# EAGLE design game_board (EAGLE 9.3.2)
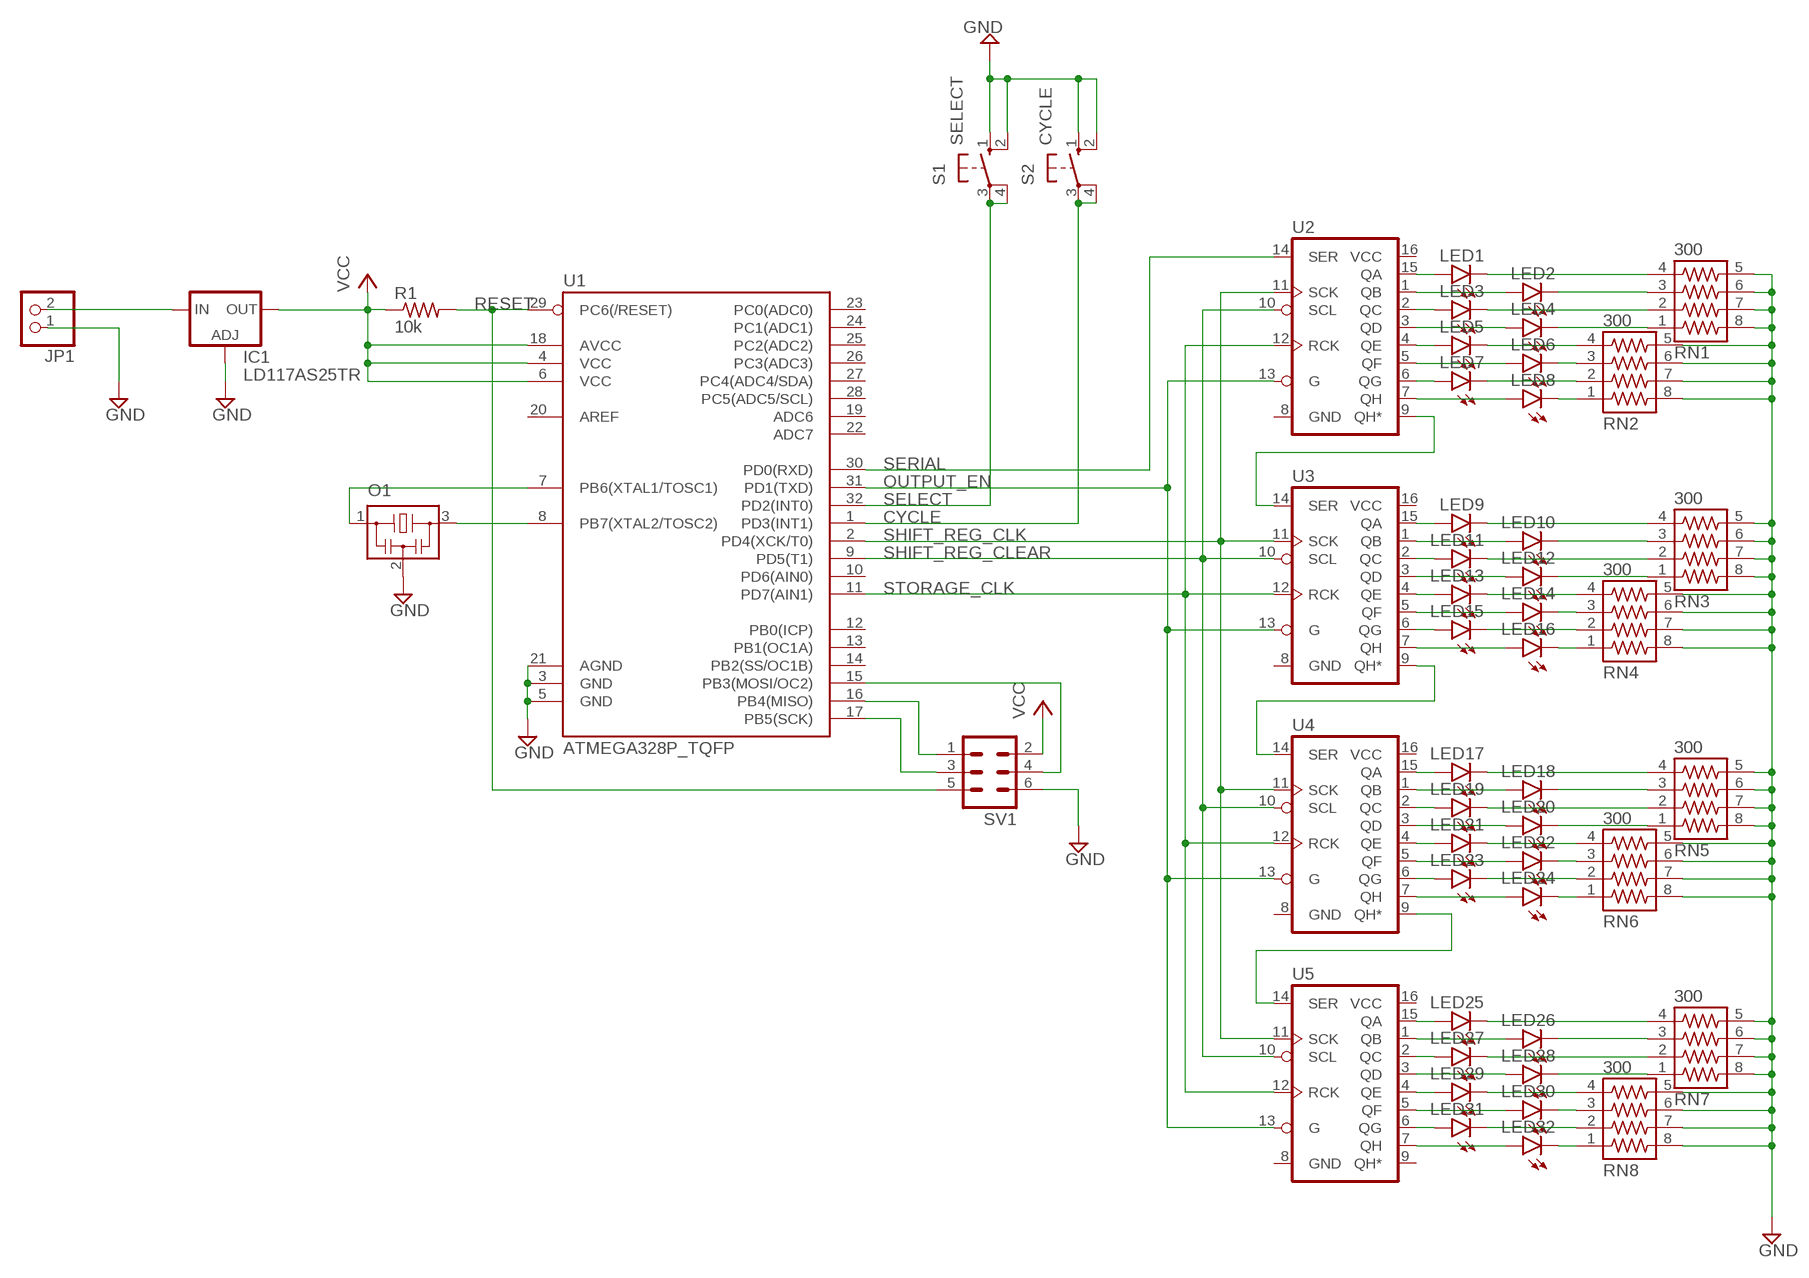
[diagram p0: schematic, sheet 1]

## Parts
IC1  LD117AS25TR  [SOT223]
JP1  PINHD-1X2  [1X02]
LED1  LEDSML0805  [SML0805]
LED2  LEDSML0805  [SML0805]
LED3  LEDSML0805  [SML0805]
LED4  LEDSML0805  [SML0805]
LED5  LEDSML0805  [SML0805]
LED6  LEDSML0805  [SML0805]
LED7  LEDSML0805  [SML0805]
LED8  LEDSML0805  [SML0805]
LED9  LEDSML0805  [SML0805]
LED10  LEDSML0805  [SML0805]
LED11  LEDSML0805  [SML0805]
LED12  LEDSML0805  [SML0805]
LED13  LEDSML0805  [SML0805]
LED14  LEDSML0805  [SML0805]
LED15  LEDSML0805  [SML0805]
LED16  LEDSML0805  [SML0805]
LED17  LEDSML0805  [SML0805]
LED18  LEDSML0805  [SML0805]
LED19  LEDSML0805  [SML0805]
LED20  LEDSML0805  [SML0805]
LED21  LEDSML0805  [SML0805]
LED22  LEDSML0805  [SML0805]
LED23  LEDSML0805  [SML0805]
LED24  LEDSML0805  [SML0805]
LED25  LEDSML0805  [SML0805]
LED26  LEDSML0805  [SML0805]
LED27  LEDSML0805  [SML0805]
LED28  LEDSML0805  [SML0805]
LED29  LEDSML0805  [SML0805]
LED30  LEDSML0805  [SML0805]
LED31  LEDSML0805  [SML0805]
LED32  LEDSML0805  [SML0805]
O1  CSTNE16M0V530000R0  [CSTCR6M]
R1  10k  R-US_R0603  [R0603]
RN1  300  1206_4RES_ARRAY1206  [RESCAXS80P320X250X60-8]
RN2  300  1206_4RES_ARRAY1206  [RESCAXS80P320X250X60-8]
RN3  300  1206_4RES_ARRAY1206  [RESCAXS80P320X250X60-8]
RN4  300  1206_4RES_ARRAY1206  [RESCAXS80P320X250X60-8]
RN5  300  1206_4RES_ARRAY1206  [RESCAXS80P320X250X60-8]
RN6  300  1206_4RES_ARRAY1206  [RESCAXS80P320X250X60-8]
RN7  300  1206_4RES_ARRAY1206  [RESCAXS80P320X250X60-8]
RN8  300  1206_4RES_ARRAY1206  [RESCAXS80P320X250X60-8]
S1  SELECT  10-XX  [B3F-10XX]
S2  CYCLE  10-XX  [B3F-10XX]
SV1  MA03-2  [MA03-2]
U1  ATMEGA328P_TQFP  [TQFP32-08]
U2  74595  [TSSOP16]
U3  74595  [TSSOP16]
U4  74595  [TSSOP16]
U5  74595  [TSSOP16]

## Nets
CYCLE: S2.3(P) S2.4(P1) U1.1(PD3(INT1))
GND: IC1.1(ADJ) JP1.1 O1.2 RN1.5 RN1.6 RN1.7 RN1.8 RN2.5 RN2.6 RN2.7 RN2.8 RN3.5 RN3.6 RN3.7 RN3.8 RN4.5 RN4.6 RN4.7 RN4.8 RN5.5 RN5.6 RN5.7 RN5.8 RN6.5 RN6.6 RN6.7 RN6.8 RN7.5 RN7.6 RN7.7 RN7.8 RN8.5 RN8.6 RN8.7 RN8.8 S1.1(S) S1.2(S1) S2.1(S) S2.2(S1) SV1.6 U1.3(GND) U1.5(GND) U1.21(AGND)
MISO: SV1.1 U1.16(PB4(MISO))
MOSI: SV1.4 U1.15(PB3(MOSI/OC2))
N$1: O1.1 U1.7(PB6(XTAL1/TOSC1))
N$2: O1.3 U1.8(PB7(XTAL2/TOSC2))
N$3: LED17.A U4.15(QA)
N$4: LED18.A U4.1(QB)
N$5: LED17.C RN5.4
N$6: LED18.C RN5.3
N$7: U3.9(QH*) U4.14(SER)
N$8: U2.9(QH*) U3.14(SER)
N$9: U4.9(QH*) U5.14(SER)
N$10: LED1.A U2.15(QA)
N$11: LED2.A U2.1(QB)
N$12: LED1.C RN1.4
N$13: LED2.C RN1.3
N$14: LED3.A U2.2(QC)
N$15: LED3.C RN1.2
N$16: LED4.C RN1.1
N$17: LED4.A U2.3(QD)
N$18: LED5.A U2.4(QE)
N$19: LED6.A U2.5(QF)
N$20: LED5.C RN2.4
N$21: LED6.C RN2.3
N$22: LED7.C RN2.2
N$23: LED7.A U2.6(QG)
N$24: LED8.A U2.7(QH)
N$25: LED8.C RN2.1
N$26: LED9.A U3.15(QA)
N$27: LED10.A U3.1(QB)
N$28: LED9.C RN3.4
N$29: LED10.C RN3.3
N$30: LED11.A U3.2(QC)
N$31: LED11.C RN3.2
N$32: LED12.C RN3.1
N$33: LED12.A U3.3(QD)
N$34: LED13.A U3.4(QE)
N$35: LED14.A U3.5(QF)
N$36: LED13.C RN4.4
N$37: LED14.C RN4.3
N$38: LED15.C RN4.2
N$39: LED15.A U3.6(QG)
N$40: LED16.A U3.7(QH)
N$41: LED16.C RN4.1
N$42: LED19.A U4.2(QC)
N$43: LED19.C RN5.2
N$44: LED20.C RN5.1
N$45: LED20.A U4.3(QD)
N$46: LED21.A U4.4(QE)
N$47: LED22.A U4.5(QF)
N$48: LED21.C RN6.4
N$49: LED22.C RN6.3
N$50: LED23.C RN6.2
N$51: LED23.A U4.6(QG)
N$52: LED24.A U4.7(QH)
N$53: LED24.C RN6.1
N$54: LED25.A U5.15(QA)
N$55: LED26.A U5.1(QB)
N$56: LED25.C RN7.4
N$57: LED26.C RN7.3
N$58: LED27.A U5.2(QC)
N$59: LED27.C RN7.2
N$60: LED28.C RN7.1
N$61: LED28.A U5.3(QD)
N$62: LED29.A U5.4(QE)
N$63: LED30.A U5.5(QF)
N$64: LED29.C RN8.4
N$65: LED30.C RN8.3
N$66: LED31.C RN8.2
N$67: LED31.A U5.6(QG)
N$68: LED32.A U5.7(QH)
N$69: LED32.C RN8.1
N$76: IC1.3(IN) JP1.2
OUTPUT_EN: U1.31(PD1(TXD)) U2.13(G) U3.13(G) U4.13(G) U5.13(G)
RESET: R1.2 SV1.5 U1.29(PC6(/RESET))
SCK: SV1.3 U1.17(PB5(SCK))
SELECT: S1.3(P) S1.4(P1) U1.32(PD2(INT0))
SERIAL: U1.30(PD0(RXD)) U2.14(SER)
SHIFT_REG_CLEAR: U1.9(PD5(T1)) U2.10(SCL) U3.10(SCL) U4.10(SCL) U5.10(SCL)
SHIFT_REG_CLK: U1.2(PD4(XCK/T0)) U2.11(SCK) U3.11(SCK) U4.11(SCK) U5.11(SCK)
STORAGE_CLK: U1.11(PD7(AIN1)) U2.12(RCK) U3.12(RCK) U4.12(RCK) U5.12(RCK)
VCC: IC1.4(OUT) R1.1 SV1.2 U1.4(VCC) U1.6(VCC) U1.18(AVCC)
Unconnected: U1.10(PD6(AIN0)) U1.12(PB0(ICP)) U1.13(PB1(OC1A)) U1.14(PB2(SS/OC1B)) U1.19(ADC6) U1.20(AREF) U1.22(ADC7) U1.23(PC0(ADC0)) U1.24(PC1(ADC1)) U1.25(PC2(ADC2)) U1.26(PC3(ADC3)) U1.27(PC4(ADC4/SDA)) U1.28(PC5(ADC5/SCL)) U5.9(QH*)

## Power pins joined to a net without a drawn wire
GND: U2.8(GND) U3.8(GND) U4.8(GND) U5.8(GND)
VCC: U2.16(VCC) U3.16(VCC) U4.16(VCC) U5.16(VCC)

## Library data of the parts
IC1 = v-reg:LD117A?*: Low drop fixed and adjustable positive voltage regulators 1 A Source: http://www.st.com/stonline/products/literature/ds/7194/ld1117axx.pdf
JP1 = pinhead:PINHD-1X2: PIN HEADER
LED1-LED32 = led:LED: LED OSRAM: - CHIPLED LG R971, LG N971, LY N971, LG Q971, LY Q971, LO R971, LY R971 LH N974, LH R974 LS Q976, LO Q976, LY Q976 LO Q996 - Hyper CHIPLED LW Q18S LB Q993, LB Q99A, LB R99A - SideLED LS A670, LO A670, LY A670, LG A670, LP A670 LB A673, LV A673, LT A673, LW A673 LH A674 LY A675 LS A676, LA A676, LO A676, LY A676, LW A676 LS A679, LY A679, LG A679 - Hyper Micro SIDELED® LS Y876, LA Y876, LO Y876, LY Y876 LT Y87S - SmartLED LW L88C, LW L88S LB L89C, LB L89S, LG L890 LS L89K, LO L89K, LY L89K LS L896, LA L896, LO L896, LY L896 - TOPLED LS T670, LO T670, LY T670, LG T670, LP T670 LSG T670, LSP T670, LSY T670, LOP T670, LYG T670 LG T671, LOG T671, LSG T671 LB T673, LV T673, LT T673, LW T673 LH T674 LS T676, LA T676, LO T676, LY T676, LB T676, LH T676, LSB T676, LW T676 LB T67C, LV T67C, LT T67C, LS T67K, LO T67K, LY T67K, LW E67C LS E67B, LA E67B, LO E67B, LY E67B, LB E67C, LV E67C, LT E67C LW T67C LS T679, LY T679, LG T679 LS T770, LO T770, LY T770, LG T770, LP T770 LB T773, LV T773, LT T773, LW T773 LH T774 LS E675, LA E675, LY E675, LS T675 LS T776, LA T776, LO T776, LY T776, LB T776 LHGB T686 LT T68C, LB T68C - Hyper Mini TOPLED® LB M676 - Mini TOPLED Santana® LG M470 LS M47K, LO M47K, LY M47K Source: http://www.osram.convergy.de LUXEON: - LUMILED® LXK2-PW12-R00, LXK2-PW12-S00, LXK2-PW14-U00, LXK2-PW14-V00 LXK2-PM12-R00, LXK2-PM12-S00, LXK2-PM14-U00 LXK2-PE12-Q00, LXK2-PE12-R00, LXK2-PE12-S00, LXK2-PE14-T00, LXK2-PE14-U00 LXK2-PB12-K00, LXK2-PB12-L00, LXK2-PB12-M00, LXK2-PB14-N00, LXK2-PB14-P00, LXK2-PB14-Q00 LXK2-PR12-L00, LXK2-PR12-M00, LXK2-PR14-Q00, LXK2-PR14-R00 LXK2-PD12-Q00, LXK2-PD12-R00, LXK2-PD12-S00 LXK2-PH12-R00, LXK2-PH12-S00 LXK2-PL12-P00, LXK2-PL12-Q00, LXK2-PL12-R00 Source: www.luxeon.com KINGBRIGHT: KA-3528ASYC Source: www.kingbright.com
O1 = murata-resonators:CSTNE16M0V530000R0
R1 = resistor:R-US_: RESISTOR, American symbol
RN1-RN8 = res4array1206:1206_4RES_ARRAY
S1 S2 = switch-omron:10-XX: OMRON SWITCH; MPN: B3F-1000; OC_FARNELL: 176432; OC_NEWARK: 36M3542
SV1 = con-lstb:MA03-2: PIN HEADER; OC_FARNELL: unknown; OC_NEWARK: unknown
U1 = SparkFun-IC-Microcontroller:ATMEGA328P_TQFP: Popular 328P in QFP Storefront component: ATmega328 - TQFP <https://www.sparkfun.com/products/13448> (COM-13448) Datasheet <http://www.sparkfun.com/datasheets/Components/SMD/ATMega328.pdf> SparkFun Products SparkFun RedBoard - Programmed with Arduino <https://www.sparkfun.com/products/12757> (DEV-12757) Arduino Pro Mini 328 - 5V/16MHz <https://www.sparkfun.com/products/11113> (DEV-11113) Arduino Pro Mini 328 - 3.3V/8MHz <https://www.sparkfun.com/products/11114> (DEV-11114) SparkFun OpenLog <https://www.sparkfun.com/products/13712> (DEV-13712) SparkFun MicroView - OLED Arduino Module <https://www.sparkfun.com/products/12923> (DEV-12923) SparkFun Digital Sandbox <https://www.sparkfun.com/products/12651> (DEV-12651) SparkFun PicoBoard <https://www.sparkfun.com/products/11888> (WIG-11888) Arduino Fio <https://www.sparkfun.com/products/10116> (DEV-10116) LilyPad Arduino 328 Main Board <https://www.sparkfun.com/products/13342> (DEV-13342) SparkFun RedStick <https://www.sparkfun.com/products/13741> (DEV-13741) LilyPad MP3 <https://www.sparkfun.com/products/11013> (DEV-11013) LilyPad Arduino SimpleSnap <https://www.sparkfun.com/products/10941> (DEV-10941) SparkFun Stepoko <https://www.sparkfun.com/products/13899> (ROB-13899) SparkFun Geiger Counter <https://www.sparkfun.com/products/11345> (SEN-11345) SparkFun EL Sequencer <https://www.sparkfun.com/products/12781> (COM-12781) Arduino Pro 328 - 5V/16MHz <https://www.sparkfun.com/products/10915> (DEV-10915) CryptoCape <https://www.sparkfun.com/products/12773> (DEV-12773) SparkFun IR Thermometer Evaluation Board - MLX90614 <https://www.sparkfun.com/products/10740> (SEN-10740) SparkFun RedBot Mainboard <https://www.sparkfun.com/products/12097> (ROB-12097) Arduino Pro 328 - 3.3V/8MHz <https://www.sparkfun.com/products/10914> (DEV-10914) SparkFun Block for Intel® Edison - Arduino <https://www.sparkfun.com/products/13036> (DEV-13036) SparkFun Simon Says - Surface Mount Soldering Kit <https://www.sparkfun.com/products/10935> (KIT-10935) SparkFun 7-Segment Serial Display - Red <https://www.sparkfun.com/products/11441> (COM-11441) SparkFun 7-Segment Serial Display - White <https://www.sparkfun.com/products/11629> (COM-11629) SparkFun 7-Segment Serial Display - Yellow <https://www.sparkfun.com/products/11443> (COM-11443) SparkFun 7-Segment Serial Display - Kelly Green <https://www.sparkfun.com/products/11440> (COM-11440) SparkFun 7-Segment Serial Display - Blue <https://www.sparkfun.com/products/11442> (COM-11442) SparkFun OpenSegment Serial Display - 20mm (Blue) <https://www.sparkfun.com/products/11647> (COM-11647) SparkFun OpenSegment Serial Display - 20mm (Green) <https://www.sparkfun.com/products/11646> (COM-11646) SparkFun OpenSegment Serial Display - 20mm (White) <https://www.sparkfun.com/products/11648> (COM-11648) SparkFun OpenSegment Serial Display - 20mm (Red) <https://www.sparkfun.com/products/11644> (COM-11644) SparkFun OpenSegment Serial Display - 20mm (Yellow) <https://www.sparkfun.com/products/11645> (COM-11645) SparkFun OpenSegment Shield <https://www.sparkfun.com/products/13190> (DEV-13190); PROD_ID: IC-09069
U2-U5 = SparkFun-IC-Logic:74*595: 8-Bit Shift Register (Serial to Parallel) Datasheet <http://cdn.sparkfun.com/datasheets/BreakoutBoards/MM74HC595.pdf> SparkFun Products SparkFun Shift Register Breakout - 74HC595 <https://www.sparkfun.com/products/10680> (BOB-10680)

## Board
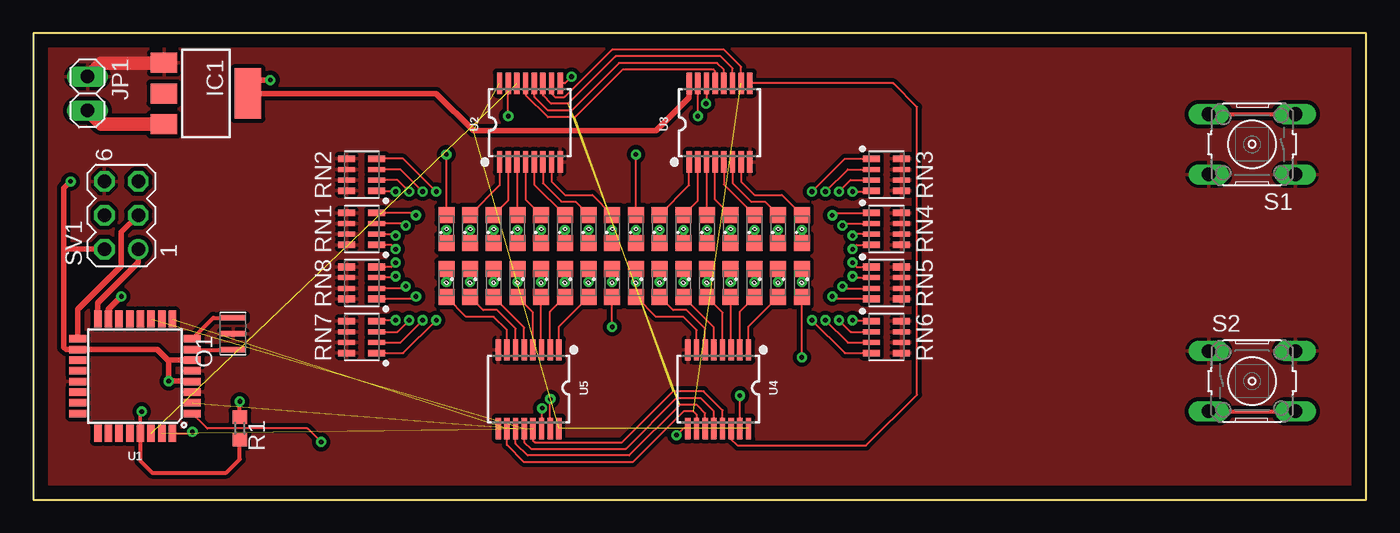
[diagram p1: board, top side]
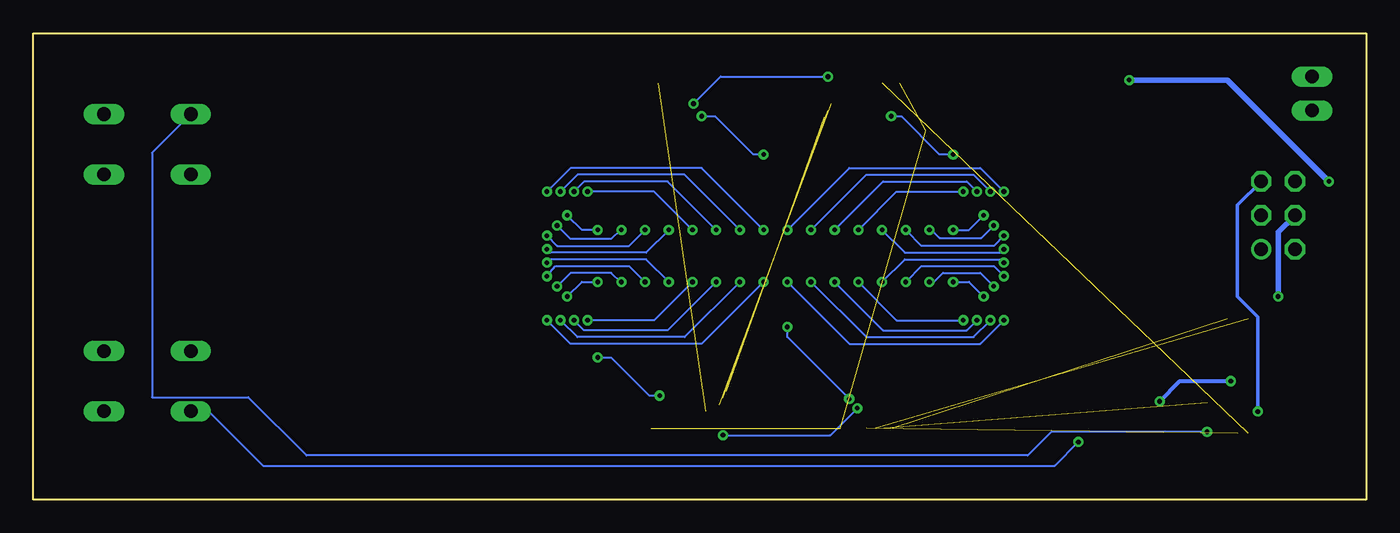
[diagram p2: board, bottom side, seen from below]

Size 100 x 35 mm. Coordinates in mm from the lower left corner, seen from the top.
Outline: 0,0 100,0 100,35 0,35 0,0
Copper layers (1*16): Top 0.035mm / dielectric 1.5mm / Bottom 0.035mm
Design rules "default": minimum track width 6mil, minimum drill 0.35mm, track to track 6mil, track to pad 6mil, pad to pad 6mil, via to via 6mil, smd to smd 6mil, copper to edge 40mil, drill to drill 6mil, minimum pad ring 10mil, minimum via ring 8mil, stop-mask expansion 4mil, vias tented up to drill 0mil, thermal gap 10mil

### Footprints (pad centres in the part's own frame; a part is rotated, then mirrored left to right if it is on the bottom)
SOT223 = smd 1.5 x 2: 1 -2.3,-3.15; 2 0,-3.15; 3 2.3,-3.15 | smd 3.8 x 2: 4 0,3.15
1X02 = drill 1.016 long: 1 -1.27,0; 2 1.27,0
SML0805 = smd 1.2 x 1.2: A 1.05,0; C -1.05,0
CSTCR6M = smd 0.4 x 1.9: 1 -1.2,0; 2 0,0; 3 1.2,0
R0603 = smd 1 x 1.1: 1 -0.85,0; 2 0.85,0
RESCAXS80P320X250X60-8 = smd 1.268 x 0.489: 1 -1.131,1.2; 4 -1.131,-1.2; 5 1.131,-1.2; 8 1.131,1.2 | smd 1.268 x 0.372: 2 -1.131,0.4; 3 -1.131,-0.4; 6 1.131,-0.4; 7 1.131,0.4
B3F-10XX = drill 1.016 long: 1 -3.251,2.261; 2 3.251,2.261; 3 -3.251,-2.261; 4 3.251,-2.261
MA03-2 = drill 1.016: 1 -2.54,-1.27 | drill 1.016 octagon: 2 -2.54,1.27; 3 0,-1.27; 4 0,1.27; 5 2.54,-1.27; 6 2.54,1.27
TQFP32-08 = smd 1.27 x 0.559: 1 -4.293,2.8; 2 -4.293,2; 3 -4.293,1.2; 4 -4.293,0.4; 5 -4.293,-0.4; 6 -4.293,-1.2; 7 -4.293,-2; 8 -4.293,-2.8; 17 4.293,-2.8; 18 4.293,-2; 19 4.293,-1.2; 20 4.293,-0.4; 21 4.293,0.4; 22 4.293,1.2; 23 4.293,2; 24 4.293,2.8 | smd 0.559 x 1.27: 9 -2.8,-4.293; 10 -2,-4.293; 11 -1.2,-4.293; 12 -0.4,-4.293; 13 0.4,-4.293; 14 1.2,-4.293; 15 2,-4.293; 16 2.8,-4.293; 25 2.8,4.293; 26 2,4.293; 27 1.2,4.293; 28 0.4,4.293; 29 -0.4,4.293; 30 -1.2,4.293; 31 -2,4.293; 32 -2.8,4.293
TSSOP16 = smd 0.4 x 1.6: 1 -2.225,-2.85; 2 -1.575,-2.85; 3 -0.925,-2.85; 4 -0.275,-2.85; 5 0.375,-2.85; 6 1.025,-2.85; 7 1.675,-2.85; 8 2.325,-2.85; 9 2.325,3.05; 10 1.675,3.05; 11 1.025,3.05; 12 0.375,3.05; 13 -0.275,3.05; 14 -0.925,3.05; 15 -1.575,3.05; 16 -2.225,3.05

### Placement (x,y rotation side)
IC1  12.95,30.48 270 top
JP1  4.06,30.48 270 top
LED1  30.99,20.32 90 top
LED2  32.77,20.32 90 top
LED3  34.54,20.32 90 top
LED4  36.32,20.32 90 top
LED5  38.1,20.32 90 top
LED6  39.88,20.32 90 top
LED7  41.66,20.32 90 top
LED8  43.43,20.32 90 top
LED9  45.21,20.32 90 top
LED10  46.99,20.32 90 top
LED11  48.77,20.32 90 top
LED12  50.55,20.32 90 top
LED13  52.32,20.32 90 top
LED14  54.1,20.32 90 top
LED15  55.88,20.32 90 top
LED16  57.66,20.32 90 top
LED17  57.66,16.26 270 top
LED18  55.88,16.26 270 top
LED19  54.1,16.26 270 top
LED20  52.32,16.26 270 top
LED21  50.55,16.26 270 top
LED22  48.77,16.26 270 top
LED23  46.99,16.26 270 top
LED24  45.21,16.26 270 top
LED25  43.43,16.26 270 top
LED26  41.66,16.26 270 top
LED27  39.88,16.26 270 top
LED28  38.1,16.26 270 top
LED29  36.32,16.26 270 top
LED30  34.54,16.26 270 top
LED31  32.77,16.26 270 top
LED32  30.99,16.26 270 top
O1  14.99,12.45 90 top
R1  15.49,5.33 270 top
RN1  24.64,20.32 180 top
RN2  24.64,24.38 180 top
RN3  64.01,24.38 0 top
RN4  64.01,20.32 0 top
RN5  64.01,16.26 0 top
RN6  64.01,12.19 0 top
RN7  24.64,12.19 180 top
RN8  24.64,16.26 180 top
S1  91.44,26.67 180 top
S2  91.44,8.89 0 top
SV1  6.6,21.34 90 top
U1  7.63,9.27 180 top
U2  37.21,28.19 0 top
U3  51.44,28.19 0 top
U4  51.44,8.38 180 top
U5  37.21,8.38 180 top

### Tracks (layer width: path | path; a pad name or v marks a point on that pad's centre or on a via)
CYCLE  (via drill 0.35)
  Top 0.152: v21.59,4.32 20.57,5.33 13.06,5.33 U1.1
  Top 0.305: S2.3 S2.4
  Bottom 0.152: S2.3 86.86,6.63 82.77,2.54 23.37,2.54 v21.59,4.32
GND
  Top 1.016: IC1.1 9.79,32.77 5.08,32.77 JP1.1
  pour Top (isolate 0.305): 0,35 0,0 100,0 100,35
MISO
  Top 0.406: U1.16 4.83,14.74 7.87,17.78 SV1.1
MOSI  (via drill 0.35)
  Top 0.406: U1.15 5.63,14.27 v6.6,15.24
  Bottom 0.406: v6.6,15.24 6.6,20.07 SV1.4
N$1
  Top 0.305: U1.7 11.95,11.25 O1.1
N$2
  Top 0.305: U1.8 13.51,13.65 O1.3
N$3  (via drill 0.35)
  Top 0.152: U4.15 v53.01,7.8 | v57.66,10.67 LED17.A
  Bottom 0.152: v57.66,10.67 56.64,10.67 53.77,7.8 v53.01,7.8
N$4
  Top 0.152: U4.1 53.66,12.99 LED18.A
N$5  (via drill 0.35)
  Top 0.152: LED17.C v57.66,16.34 | RN5.4 60.13,15.06 v59.94,15.24
  Bottom 0.152: v59.94,15.24 58.85,16.34 v57.66,16.34
N$6  (via drill 0.35)
  Top 0.152: LED18.C v55.88,16.34 | v60.71,16 60.85,15.86 RN5.3
  Bottom 0.152: v55.88,16.34 55.96,16.34 56.64,17.02 59.69,17.02 v60.71,16
N$7
  Top 0.152: U4.14 52.36,4.54 52.83,4.06 62.48,4.06 66.29,7.87 66.29,29.46 64.52,31.24 U3.9
N$8  (via drill 0.35)
  Top 0.152: U3.14 50.51,29.76 v50.47,29.72 | v40.39,31.75 39.88,31.24 U2.9
  Bottom 0.152: v50.47,29.72 48.44,31.75 v40.39,31.75
N$9  (via drill 0.35)
  Top 0.152: U4.9 48.77,5.33 v48.26,4.83 | v38.18,6.86 38.14,6.82 U5.14
  Bottom 0.152: v48.26,4.83 40.21,4.83 v38.18,6.86
N$10  (via drill 0.35)
  Top 0.152: LED1.A v30.99,25.91 | v35.64,28.78 U2.15
  Bottom 0.152: v35.64,28.78 34.87,28.78 32,25.91 v30.99,25.91
N$11
  Top 0.152: U2.1 34.99,23.59 LED2.A
N$12  (via drill 0.35)
  Top 0.152: LED1.C v30.99,20.24 | v28.7,21.34 28.52,21.52 RN1.4
  Bottom 0.152: v30.99,20.24 29.8,20.24 v28.7,21.34
N$13  (via drill 0.35)
  Top 0.152: LED2.C v32.77,20.24 | v27.94,20.57 27.79,20.72 RN1.3
  Bottom 0.152: v32.77,20.24 32.61,20.24 32,19.63 28.88,19.63 v27.94,20.57
N$14
  Top 0.152: U2.2 35.64,22.46 LED3.A
N$15  (via drill 0.35)
  Top 0.152: LED3.C v34.54,20.24 | RN1.2 27.07,19.92 v27.18,19.81
  Bottom 0.152: v27.18,19.81 27.94,19.05 33.35,19.05 v34.54,20.24
N$16  (via drill 0.35)
  Top 0.152: LED4.C v36.32,20.24 | v27.18,18.8 26.85,19.12 RN1.1
  Bottom 0.152: v36.32,20.24 34.62,18.54 27.43,18.54 v27.18,18.8
N$17
  Top 0.152: U2.3 36.29,21.41 LED4.A
N$18
  Top 0.152: U2.4 36.94,22.53 LED5.A
N$19
  Top 0.152: U2.5 37.59,23.66 LED6.A
N$20  (via drill 0.35)
  Top 0.152: LED5.C v38.1,20.24 | v30.23,23.11 27.76,25.58 RN2.4
  Bottom 0.152: v38.1,20.24 35.23,23.11 v30.23,23.11
N$21  (via drill 0.35)
  Top 0.152: LED6.C v39.88,20.24 | v29.21,23.11 27.54,24.78 RN2.3
  Bottom 0.152: v39.88,20.24 36.24,23.88 29.97,23.88 v29.21,23.11
N$22  (via drill 0.35)
  Top 0.152: LED7.C v41.66,20.24 | RN2.2 27.32,23.98 v28.19,23.11
  Bottom 0.152: v41.66,20.24 37.51,24.38 29.46,24.38 v28.19,23.11
N$23
  Top 0.152: U2.6 38.24,23.74 39.62,22.35 40.67,22.35 LED7.A
N$24
  Top 0.152: U2.7 38.89,23.85 39.88,22.86 41.94,22.86 LED8.A
N$25  (via drill 0.35)
  Top 0.152: LED8.C v43.43,20.24 | v27.18,23.11 25.84,23.11 RN2.1
  Bottom 0.152: v43.43,20.24 38.78,24.89 28.96,24.89 v27.18,23.11
N$26  (via drill 0.35)
  Top 0.152: LED9.A v45.21,25.91 | v49.86,28.78 U3.15
  Bottom 0.152: v49.86,28.78 48.84,28.78 45.97,25.91 v45.21,25.91
N$27
  Top 0.152: LED10.A 49.21,23.59 U3.1
N$28  (via drill 0.35)
  Top 0.152: LED9.C v45.21,20.24 | v61.47,23.11 62.81,23.11 RN3.4
  Bottom 0.152: v45.21,20.24 49.87,24.89 59.69,24.89 v61.47,23.11
N$29  (via drill 0.35)
  Top 0.152: LED10.C v46.99,20.24 | RN3.3 61.32,23.98 v60.45,23.11
  Bottom 0.152: v46.99,20.24 51.13,24.38 59.18,24.38 v60.45,23.11
N$30
  Top 0.152: LED11.A 49.86,22.46 U3.2
N$31  (via drill 0.35)
  Top 0.152: LED11.C v48.77,20.24 | v59.44,23.11 61.11,24.78 RN3.2
  Bottom 0.152: v48.77,20.24 52.41,23.88 58.67,23.88 v59.44,23.11
N$32  (via drill 0.35)
  Top 0.152: LED12.C v50.55,20.24 | RN3.1 60.89,25.58 v58.42,23.11
  Bottom 0.152: v50.55,20.24 53.42,23.11 v58.42,23.11
N$33
  Top 0.152: LED12.A 50.55,25.31 U3.3
N$34
  Top 0.152: LED13.A 51.16,22.53 U3.4
N$35
  Top 0.152: U3.5 51.81,23.66 LED14.A
N$36  (via drill 0.35)
  Top 0.152: LED13.C v52.32,20.24 | v61.47,18.8 61.79,19.12 RN4.4
  Bottom 0.152: v52.32,20.24 54.02,18.54 61.21,18.54 v61.47,18.8
N$37  (via drill 0.35)
  Top 0.152: LED14.C v54.1,20.24 | RN4.3 61.58,19.92 v61.47,19.81
  Bottom 0.152: v61.47,19.81 60.71,19.05 55.29,19.05 v54.1,20.24
N$38  (via drill 0.35)
  Top 0.152: LED15.C v55.88,20.24 | v60.71,20.57 60.85,20.72 RN4.2
  Bottom 0.152: v55.88,20.24 55.96,20.24 56.64,19.56 59.69,19.56 v60.71,20.57
N$39
  Top 0.152: U3.6 52.46,23.74 53.85,22.35 54.9,22.35 LED15.A
N$40
  Top 0.152: U3.7 53.11,23.85 54.1,22.86 56.17,22.86 LED16.A
N$41  (via drill 0.35)
  Top 0.152: LED16.C v57.66,20.24 | v59.94,21.34 60.13,21.52 RN4.1
  Bottom 0.152: v57.66,20.24 58.85,20.24 v59.94,21.34
N$42
  Top 0.152: U4.2 53.01,14.11 LED19.A
N$43  (via drill 0.35)
  Top 0.152: LED19.C v54.1,16.34 | v61.47,16.76 61.58,16.66 RN5.2
  Bottom 0.152: v61.47,16.76 60.81,17.53 55.29,17.53 v54.1,16.34
N$44  (via drill 0.35)
  Top 0.152: LED20.C v52.32,16.34 | v61.47,17.78 61.79,17.46 RN5.1
  Bottom 0.152: v52.32,16.34 54.02,18.03 61.21,18.03 v61.47,17.78
N$45
  Top 0.152: U4.3 52.36,15.17 LED20.A
N$46
  Top 0.152: U4.4 51.71,14.04 LED21.A
N$47
  Top 0.152: U4.5 51.06,12.91 LED22.A
N$48  (via drill 0.35)
  Top 0.152: LED21.C v50.55,16.34 | v58.42,13.46 60.89,10.99 RN6.4
  Bottom 0.152: v50.55,16.34 53.42,13.46 v58.42,13.46
N$49  (via drill 0.35)
  Top 0.152: LED22.C v48.77,16.34 | RN6.3 61.11,11.79 v59.44,13.46
  Bottom 0.152: v48.77,16.34 52.41,12.7 58.67,12.7 v59.44,13.46
N$50  (via drill 0.35)
  Top 0.152: LED23.C v46.99,16.34 | v60.45,13.46 61.32,12.59 RN6.2
  Bottom 0.152: v46.99,16.34 51.13,12.19 59.18,12.19 v60.45,13.46
N$51
  Top 0.152: U4.6 50.41,12.84 49.02,14.22 48.01,14.22 47.02,15.21 LED23.A
N$52
  Top 0.152: U4.7 49.76,12.72 48.77,13.72 46.74,13.72 45.25,15.21 LED24.A
N$53  (via drill 0.35)
  Top 0.152: LED24.C v45.21,16.34 | v61.47,13.46 62.81,13.46 RN6.1
  Bottom 0.152: v45.21,16.34 49.87,11.68 59.69,11.68 v61.47,13.46
N$54  (via drill 0.35)
  Top 0.152: U5.15 v38.79,7.54 | v43.43,12.95 LED25.A
  Bottom 0.152: v43.43,12.95 43.43,12.19 v38.79,7.54
N$55
  Top 0.152: U5.1 39.44,12.99 LED26.A
N$56  (via drill 0.35)
  Top 0.152: LED25.C v43.43,16.34 | v27.18,13.46 25.84,13.46 RN7.4
  Bottom 0.152: v43.43,16.34 38.78,11.68 28.96,11.68 v27.18,13.46
N$57  (via drill 0.35)
  Top 0.152: RN7.3 27.32,12.59 v28.19,13.46 | LED26.C v41.66,16.34
  Bottom 0.152: v28.19,13.46 29.46,12.19 37.51,12.19 v41.66,16.34
N$58
  Top 0.152: U5.2 38.79,14.11 LED27.A
N$59  (via drill 0.35)
  Top 0.152: RN7.2 27.54,11.79 v29.21,13.46 | LED27.C v39.88,16.34
  Bottom 0.152: v29.21,13.46 29.97,12.7 36.24,12.7 v39.88,16.34
N$60  (via drill 0.35)
  Top 0.152: RN7.1 27.76,10.99 v30.23,13.46 | LED28.C v38.1,16.34
  Bottom 0.152: v38.1,16.34 35.23,13.46 v30.23,13.46
N$61
  Top 0.152: U5.3 38.1,11.27 LED28.A
N$62
  Top 0.152: U5.4 37.49,14.04 LED29.A
N$63
  Top 0.152: U5.5 36.84,12.91 LED30.A
N$64  (via drill 0.35)
  Top 0.152: LED29.C v36.32,16.34 | v27.18,17.78 26.85,17.46 RN8.4
  Bottom 0.152: v36.32,16.34 34.62,18.03 27.43,18.03 v27.18,17.78
N$65  (via drill 0.35)
  Top 0.152: LED30.C v34.54,16.34 | v27.18,16.76 27.07,16.66 RN8.3
  Bottom 0.152: v34.54,16.34 33.35,17.53 27.94,17.53 v27.18,16.76
N$66  (via drill 0.35)
  Top 0.152: LED31.C v32.77,16.34 | v27.94,16 27.79,15.86 RN8.2
  Bottom 0.152: v32.77,16.34 32.43,16.34 31.75,17.02 28.96,17.02 v27.94,16
N$67
  Top 0.152: U5.6 36.19,12.84 34.8,14.22 33.75,14.22 LED31.A
N$68
  Top 0.152: U5.7 35.54,12.72 34.54,13.72 32.48,13.72 LED32.A
N$69  (via drill 0.35)
  Top 0.152: LED32.C v30.99,16.34 | v28.7,15.24 28.52,15.06 RN8.1
  Bottom 0.152: v30.99,16.34 29.8,16.34 v28.7,15.24
N$76
  Top 1.016: IC1.3 5.09,28.18 JP1.2
OUTPUT_EN  (2 unrouted)
  Top 0.152: U4.13 51.71,6.71 50.29,8.13 48.01,8.13 44.18,4.3 37.61,4.3 37.49,4.42 U5.13 | U2.13 36.94,30.37 38.61,28.7 40.64,28.7 44.21,32.27 51.04,32.27 51.16,32.15 U3.13
RESET  (via drill 0.35)
  Top 0.254: v8.13,6.6 8.03,6.51 U1.29
  Top 0.305: U1.29 8.03,2.89 8.91,2.01 14.48,2.01 15.49,3.02 R1.2
  Bottom 0.254: SV1.5 9.65,22.1 9.65,15.24 8.13,13.72 v8.13,6.6
SCK
  Top 0.406: U1.17 3.34,14.26 6.6,17.53 6.6,20.07 SV1.3
SELECT  (via drill 0.35)
  Top 0.152: U1.32 11.83,4.97 v11.94,5.08
  Top 0.305: S1.4 S1.3
  Bottom 0.152: v11.94,5.08 23.62,5.08 25.4,3.3 79.5,3.3 83.88,7.68 91.09,7.68 91.09,26.03 S1.4
SERIAL  (1 unrouted)
SHIFT_REG_CLEAR  (2 unrouted)
  Top 0.152: U5.10 35.54,4.09 36.83,2.79 44.96,2.79 48.77,6.6 49.53,6.6 49.78,6.35 49.78,5.36 U4.10 | U2.10 38.89,30.46 39.13,30.21 39.83,30.21 39.84,30.23 39.88,30.23 43.43,33.78 51.82,33.78 53.11,32.49 U3.10
SHIFT_REG_CLK  (2 unrouted)
  Top 0.152: U4.11 50.41,6.49 49.78,7.11 48.51,7.11 44.7,3.3 37.08,3.3 36.19,4.2 U5.11 | U2.11 38.24,30.34 38.86,29.72 40.13,29.72 43.69,33.27 51.56,33.27 52.46,32.38 U3.11
STORAGE_CLK  (2 unrouted)
  Top 0.152: U4.12 51.05,6.6 50.04,7.62 48.26,7.62 44.45,3.81 37.34,3.81 36.84,4.31 U5.12 | U2.12 37.59,30.23 38.61,29.21 40.39,29.21 43.94,32.77 51.31,32.77 51.81,32.26 U3.12
VCC  (via drill 0.35)  (3 unrouted)
  Top 0.305: R1.1 v15.49,7.37 | 11.9,8.89 U1.4 | 10.21,10.47 10.16,10.41
  Top 0.406: 11.9,8.89 v10.16,8.89 10.16,10.41 9.31,11.27 U1.18 2.45,11.27 2.29,11.43 2.29,18.8 | U1.6 10.21,10.47 | 2.29,18.8 SV1.2 | U3.16 49.21,30.16 46.74,27.69 33.02,27.69 30.23,30.48 IC1.4 16.1,30.99 16.61,31.5 v17.78,31.5 | v2.79,23.88 2.29,23.37 2.29,18.8
  Bottom 0.305: v15.49,7.37 13.97,8.89 v10.16,8.89
  Bottom 0.406: v2.79,23.88 10.41,31.5 v17.78,31.5